# Altium schematic sheet Vehicle_Charger_Hierarchal.SchDoc: <Document>
size Letter; Engineer: <Engineer>; Organization: UPEL; Address1: USU Power Electronics Lab; Address2: USTAR Building 620, RM 118; Address3: 1600 N 620 E; Address4: North Logan, UT 84341; DocumentNumber: 12; Revision: v1; SheetNumber: 12; SheetTotal: 16; ProjectName: <Project>
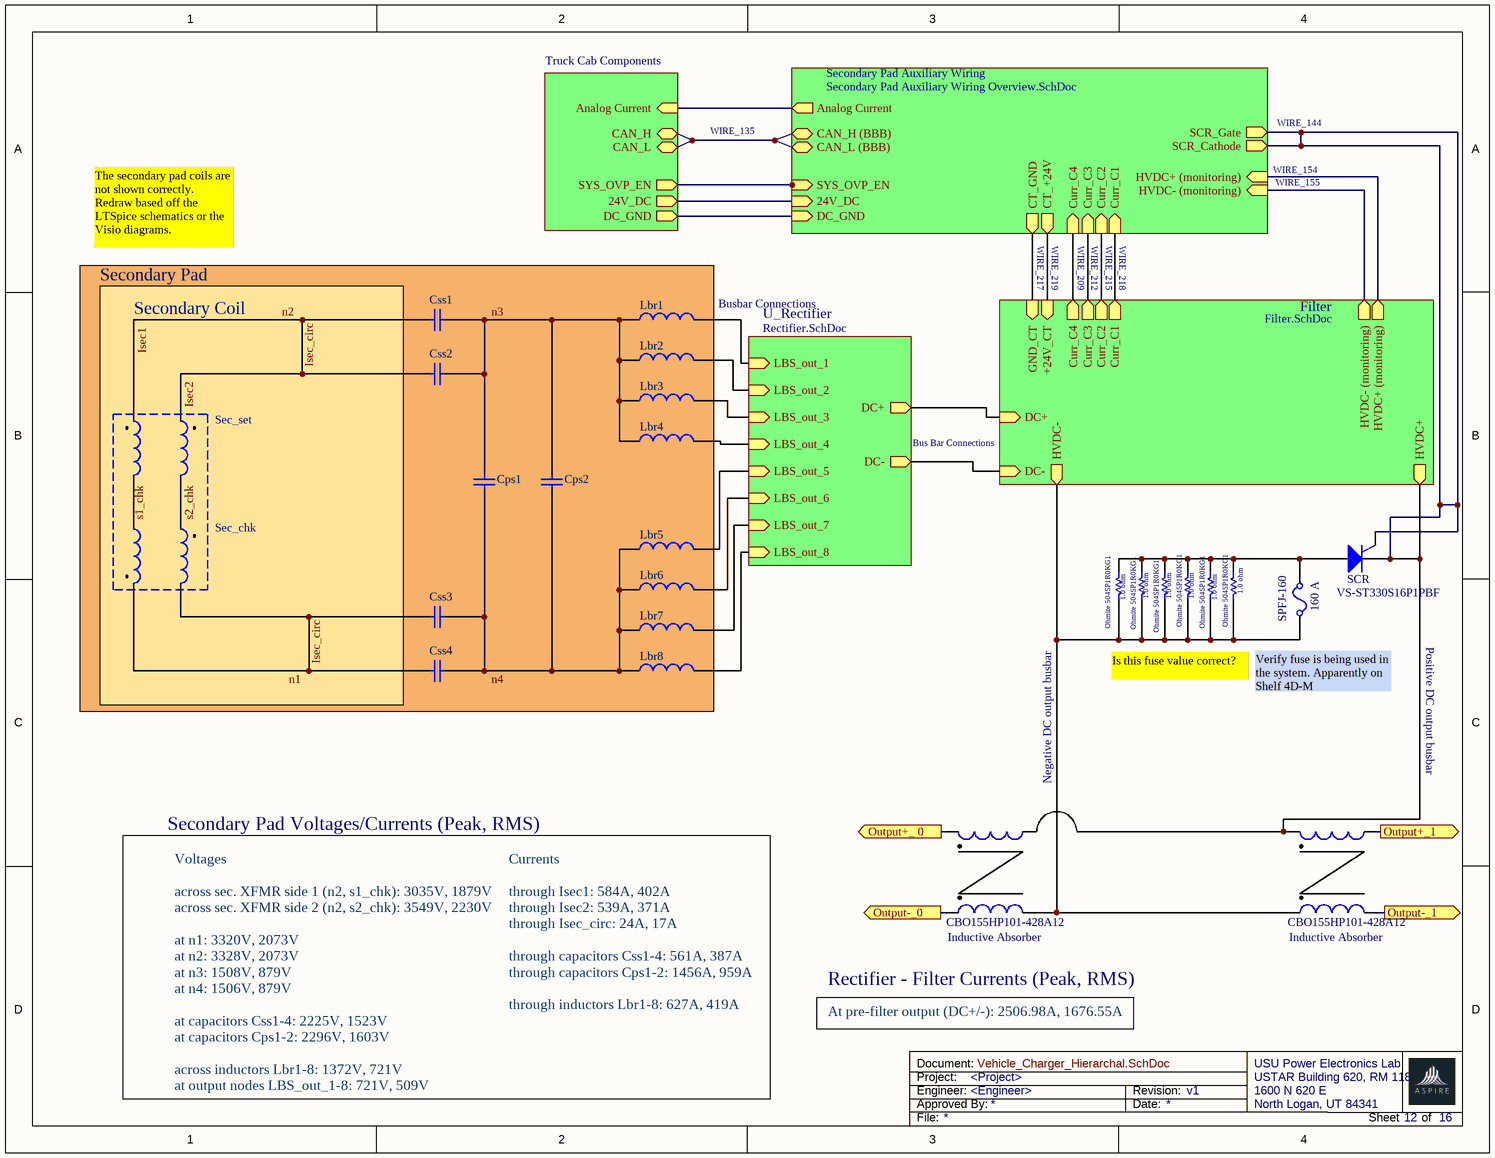
[diagram p0: Vehicle_Charger_Hierarchal.SchDoc]

## Parts
(Parts that share a designator on the sheet are numbered #1, #2 ... from top to bottom, then left to right.)
*?#1  CBO155HP101-428A12  (value not drawn)
*?#2  CBO155HP101-428A12  (value not drawn)
*?#3  CBO155HP101-428A12
*?#4  CBO155HP101-428A12
Cps1  Capacitor  (value not drawn)
Cps2  Capacitor  (value not drawn)
Css1  Capacitor  (value not drawn)
Css2  Capacitor  (value not drawn)
Css3  Capacitor  (value not drawn)
Css4  Capacitor  (value not drawn)
L?#1  Inductor  (value not drawn)
L?#2  Inductor  (value not drawn)
L?#3  Inductor  (value not drawn)
L?#4  Inductor  (value not drawn)
Lbr1  Inductor  (value not drawn)
Lbr2  Inductor  (value not drawn)
Lbr3  Inductor  (value not drawn)
Lbr4  Inductor  (value not drawn)
Lbr5  Inductor  (value not drawn)
Lbr6  Inductor  (value not drawn)
Lbr7  Inductor  (value not drawn)
Lbr8  Inductor  (value not drawn)
Ohmite_504SP1R0KG1#1  value 1.0 ohm  (hidden comment: Resistor)
Ohmite_504SP1R0KG1#2  value 1.0 ohm  (hidden comment: Resistor)
Ohmite_504SP1R0KG1#3  value 1.0 ohm  (hidden comment: Resistor)
Ohmite_504SP1R0KG1#4  value 1.0 ohm  (hidden comment: Resistor)
Ohmite_504SP1R0KG1#5  value 1.0 ohm  (hidden comment: Resistor)
Ohmite_504SP1R0KG1#6  value 1.0 ohm  (hidden comment: Resistor)
SCR  SCR Thyristror  (value not drawn)
SPFJ-160  CURRENT: 160 A  (hidden comment: Fuse)

## Sub-sheets
Filter = Filter.SchDoc: HVDC+ (out), HVDC- (out), DC- (in), DC+ (in), Curr_C1 (out), Curr_C2 (out), Curr_C3 (out), Curr_C4 (out), +24V_CT (in), GND_CT (in), HVDC- (monitoring) (out), HVDC+ (monitoring) (out)
Secondary Pad Auxiliary Wiring = Secondary Pad Auxiliary Wiring Overview.SchDoc: Curr_C1 (in), Curr_C2 (in), Curr_C3 (in), Curr_C4 (in), CAN_L (BBB) (bidir), CAN_H (BBB) (bidir), HVDC- (monitoring) (in), HVDC+ (monitoring) (in), CT_+24V (out), CT_GND (out), SCR_Cathode (out), SCR_Gate (out), SYS_OVP_EN (in), Analog Current (out), 24V_DC (in), DC_GND (in)
Truck Cab Components = File Name: Analog Current (in), 24V_DC (out), DC_GND (out), SYS_OVP_EN (out), CAN_L (bidir), CAN_H (bidir)
U_Rectifier = Rectifier.SchDoc: DC+ (out), DC- (out), LBS_out_1 (in), LBS_out_2 (in), LBS_out_3 (in), LBS_out_4 (in), LBS_out_5 (in), LBS_out_6 (in), LBS_out_7 (in), LBS_out_8 (in)

## Ports
Output+_1 (out), Output+_ 0 (out), Output-_0 (out), Output-_1 (out)

## Nets
Isec1: Css1.1 Css2.1 L?#1.2 L?#2.2  [also labelled Isec2, n2]
n1: Css3.1 Css4.1 L?#3.2 L?#4.1
n3: Cps1.2 Cps2.2 Css1.2 Css2.2 Lbr1.1 Lbr2.1 Lbr3.1 Lbr4.1
n4: Cps1.1 Cps2.1 Css3.2 Css4.2 Lbr5.1 Lbr6.1 Lbr7.1 Lbr8.1
s2_chk: L?#2.1 L?#4.2
NetL?#1_1: L?#1.1 L?#3.1
NetLbr1_2: Lbr1.2 ; sheet U_Rectifier/LBS_out_1
NetLbr2_2: Lbr2.2 ; sheet U_Rectifier/LBS_out_2
NetLbr3_2: Lbr3.2 ; sheet U_Rectifier/LBS_out_3
NetLbr4_2: Lbr4.2 ; sheet U_Rectifier/LBS_out_4
NetLbr5_2: Lbr5.2 ; sheet U_Rectifier/LBS_out_5
NetLbr6_2: Lbr6.2 ; sheet U_Rectifier/LBS_out_6
NetLbr7_2: Lbr7.2 ; sheet U_Rectifier/LBS_out_7
NetLbr8_2: Lbr8.2 ; sheet U_Rectifier/LBS_out_8
NetOhmite_504SP1R0KG1#1_1: Ohmite_504SP1R0KG1#1.1 Ohmite_504SP1R0KG1#2.1 Ohmite_504SP1R0KG1#3.1 Ohmite_504SP1R0KG1#4.1 Ohmite_504SP1R0KG1#5.1 Ohmite_504SP1R0KG1#6.1 SPFJ-160.1 ; sheet Filter/HVDC-
NetOhmite_504SP1R0KG1#1_2: Ohmite_504SP1R0KG1#1.2 Ohmite_504SP1R0KG1#2.2 Ohmite_504SP1R0KG1#3.2 Ohmite_504SP1R0KG1#4.2 Ohmite_504SP1R0KG1#5.2 Ohmite_504SP1R0KG1#6.2 SCR.1(A) SPFJ-160.2
NetSCR_2: SCR.2(K) SCR.3 ; sheet Filter/HVDC+, sheet Secondary Pad Auxiliary Wiring/SCR_Cathode, sheet Secondary Pad Auxiliary Wiring/SCR_Gate
(unnamed): sheet Filter/DC-, sheet U_Rectifier/DC-
(unnamed): sheet Filter/DC+, sheet U_Rectifier/DC+
(unnamed): sheet Filter/Curr_C1, sheet Secondary Pad Auxiliary Wiring/Curr_C1
(unnamed): sheet Filter/Curr_C2, sheet Secondary Pad Auxiliary Wiring/Curr_C2
(unnamed): sheet Filter/Curr_C3, sheet Secondary Pad Auxiliary Wiring/Curr_C3
(unnamed): sheet Filter/Curr_C4, sheet Secondary Pad Auxiliary Wiring/Curr_C4
(unnamed): sheet Filter/+24V_CT, sheet Secondary Pad Auxiliary Wiring/CT_+24V
(unnamed): sheet Filter/GND_CT, sheet Secondary Pad Auxiliary Wiring/CT_GND
(unnamed): sheet Filter/HVDC- (monitoring), sheet Secondary Pad Auxiliary Wiring/HVDC- (monitoring)
(unnamed): sheet Filter/HVDC+ (monitoring), sheet Secondary Pad Auxiliary Wiring/HVDC+ (monitoring)
(unnamed): sheet Secondary Pad Auxiliary Wiring/CAN_L (BBB), sheet Secondary Pad Auxiliary Wiring/CAN_H (BBB), sheet Truck Cab Components/CAN_L, sheet Truck Cab Components/CAN_H
(unnamed): sheet Secondary Pad Auxiliary Wiring/SYS_OVP_EN, sheet Truck Cab Components/SYS_OVP_EN
(unnamed): sheet Secondary Pad Auxiliary Wiring/Analog Current, sheet Truck Cab Components/Analog Current
(unnamed): sheet Secondary Pad Auxiliary Wiring/24V_DC, sheet Truck Cab Components/24V_DC
(unnamed): sheet Secondary Pad Auxiliary Wiring/DC_GND, sheet Truck Cab Components/DC_GND

Not connected (* = marked no-connect by the designer): *?#1 9 10; *?#2 9 10; *?#3 9 10; *?#4 9 10

## Notes on the sheet
- WIRE_135
- WIRE_144
- WIRE_154
- WIRE_155
- The secondary pad coils are not shown correctly. Redraw based off the LTSpice schematics or the Visio diagrams.
- Secondary Pad
- WIRE_217
- WIRE_219
- WIRE_209
- WIRE_212
- WIRE_215
- WIRE_218
- Secondary Coil
- (near Lbr1) Busbar Connections
- (near L?#2) Sec_set
- Bus Bar Connections
- (near L?#4) Sec_chk
- VS-ST330S16P1PBF
- Positive DC output busbar
- (near Ohmite_504SP1R0KG1#1) Is this fuse value correct?
- Verify fuse is being used in the system. Apparently on Shelf 4D-M
- Secondary Pad Voltages/Currents (Peak, RMS)
- Negative DC output busbar
- (near *?#3) Inductive Absorber
- (near *?#4) Inductive Absorber
- Currents
  through Isec1: 584A, 402A
  through Isec2: 539A, 371A
  through Isec_circ: 24A, 17A
  through capacitors Css1-4: 561A, 387A
  through capacitors Cps1-2: 1456A, 959A
  through inductors Lbr1-8: 627A, 419A
- At pre-filter output (DC+/-): 2506.98A, 1676.55A
- Rectifier - Filter Currents (Peak, RMS)
- Voltages
  across sec. XFMR side 1 (n2, s1_chk): 3035V, 1879V
  across sec. XFMR side 2 (n2, s2_chk): 3549V, 2230V
  at n1: 3320V, 2073V
  at n2: 3328V, 2073V
  at n3: 1508V, 879V
  at n4: 1506V, 879V
  at capacitors Css1-4: 2225V, 1523V
  at capacitors Cps1-2: 2296V, 1603V
  across inductors Lbr1-8: 1372V, 721V
  at output nodes LBS_out_1-8: 721V, 509V
- Labels drawn without touching a wire or pin: Isec_circ, s1_chk
- Project:
- Engineer:
- Document:
- Approved By:
- Date:
- Revision:
- File:
- Sheet
- of

## Library data of the parts
*?#1-*?#4 = CMP-006-000013-3: 59.6 uH Common Mode Inductor with coupling of 0.9996
Cps1 Cps2 = Capacitor: SimulationGenericComponent: True; Value: 1.128uF
Css1 = Capacitor: SimulationGenericComponent: True; Value: 500.02nF
Css2 = Capacitor: SimulationGenericComponent: True; Value: 499.16nF
Css3 = Capacitor: SimulationGenericComponent: True; Value: 499.07nF
Css4 = Capacitor: SimulationGenericComponent: True; Value: 499.73nF
L?#1-L?#4 = Inductor: SimulationGenericComponent: True; Value: 1u
Lbr1-Lbr8 = Inductor: SimulationGenericComponent: True; Value: 3.126uF
Ohmite_504SP1R0KG1#1-Ohmite_504SP1R0KG1#6 = Resistor: TC1: 0; SimulationGenericComponent: True; TC2: 0
SCR = SCR: IH: 50MA; IGT: 40MA; TON: 1US; VTMIN: 1V; VDRM: 50V; DVDT: 50MEG; TQ: 20US; K1: 1; SimulationGenericComponent: True; K2: 1
SPFJ-160 = Fuse: RESISTANCE: 1m; SimulationGenericComponent: True